# Altium schematic sheet USB_POWER.SchDoc
size A4; SheetNumber: 4; SheetTotal: 5
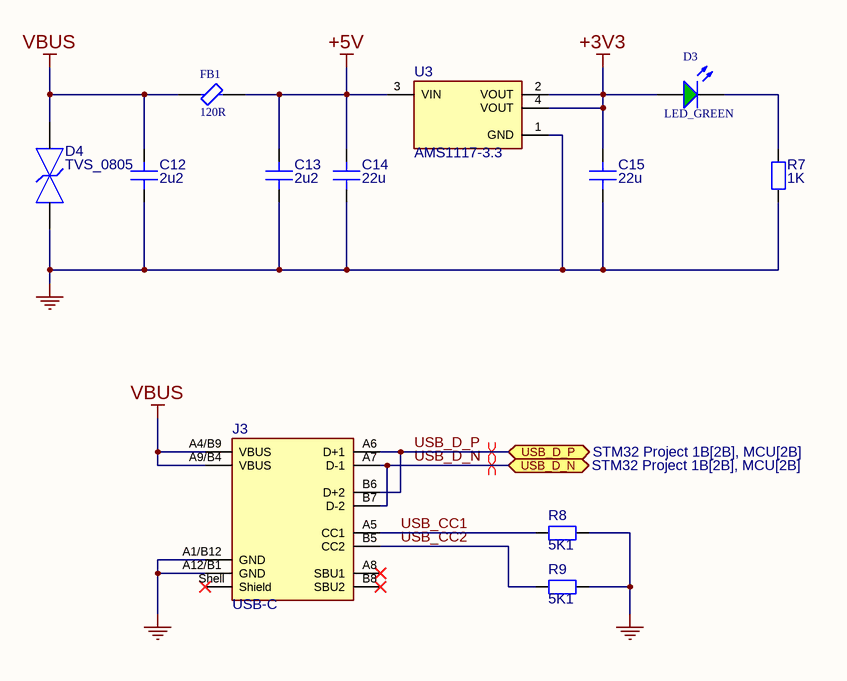
[diagram p0: USB_POWER.SchDoc]

## Parts
C12  2u2  [CAP_0805]
C13  2u2  [CAP_0805]
C14  22u  [CAP_0805]
C15  22u  [CAP_0805]
D3  LED_GREEN  [LED_GREEN_0805]
D4  TVS_0805  [TVS_0805]
FB1  120R  [FERRITE_BEAD_0805]
J3  USB-C  [USB-C SMD 16 Pin]
R7  1K  [RES_0402]
R8  5K1  [RES_0805]
R9  5K1  [RES_0805]
U3  AMS1117-3.3  [AMS1117-3.3]

## Ports
USB_D_N (bidir, see STM32 Project 1B[2B], MCU[2B]), USB_D_P (bidir, see STM32 Project 1B[2B], MCU[2B])

## Nets
+3V3: C15.2 D3.1(A) U3.2(VOUT) U3.4(VOUT)
+5V: C13.2 C14.2 FB1.2 U3.3(VIN)
GND: C12.1 C13.1 C14.1 C15.1 D4.1 J3.A1/B12(GND) J3.A12/B1(GND) R7.1 R8.2 R9.2 U3.1(GND)
VBUS: C12.2 D4.2 FB1.1 J3.A4/B9(VBUS) J3.A9/B4(VBUS)
USB_CC1: J3.A5(CC1) R8.1
USB_CC2: J3.B5(CC2) R9.1
USB_D_N: J3.A7(D-1) J3.B7(D-2) ; port USB_D_N
USB_D_P: J3.A6(D+1) J3.B6(D+2) ; port USB_D_P
NetD3_2: D3.2(K) R7.2

Not connected (* = marked no-connect by the designer): J3 A8(SBU1)* B8(SBU2)* Shell(Shield)*

## Layout directives
differential pair: USB_D_N, USB_D_P

## Library data of the parts
C12-C15 = CAP_0805: Capacitor SMD 0805 Generic; Manufacturer: *; Manufacturer Part Number: *; Tolerance: *; Voltage Rating: *; Dielectric: *
D3 = LED_GREEN_0805: Chip LED, Green, 2.2 V, -40 to 85 degC, 2-Pin SMD, Pb-Free, Tape and Reel; Manufacturer: Avago; No. of Pins: 2; Peak Wavelength: 570nm; SVHC: NoSVHC(16-Jun-2014); Dominant Wavelength: 572nm; Forward Current If: 20mA; Viewing Angle: 170deg; Lens Shape: Rectangular; PIV Max: 5V; External Width: 1.25mm; LED Type: Standard; External Depth: 0.8mm; Opto Mounting Orientation: Top; Luminous Intensity: 15mcd; Luminous Intensity Min: 4mcd; Forward Voltage VF Max: 2.6V; External Length / Height: 2mm; Bulb Size: 1.25mmx1.4mm; Light Area Height: 1mm; Voltage Vf Typ: 2.2V; Operating Temperature Max: 85degC; Datasheet Version: Oct-08; MSL: MSL2A-4weeks; Peak Forward Current: 20mA; Package Description: 2-Pin Surface Mount Device, Body 2 x 1.25 mm, Height 0.8 mm; Datasheet URL: https://datasheet.ciiva.com/29280/180495-da-01-en-chip-led-hsmg-c170-gelb-gruen-29280971.pdf; Storage Temperature Min: -40degC; LED Colour: Green; Wavelength Typ: 570nm; Mounting Type: SMD; Forward Current If Max: 20mA; Dominant Wavelength Typ: 572nm; LED Mounting: SMD; Operating Temperature Range: -30degCto+85degC; Operating Temperature Min: -30degC; Manufacturer URL: http://www.avagotech.com/; Packaging: CutTape; Luminous Intensity Typ: 15mcd; Package Reference: HSMX-C170; Storage Temperature Max: 85degC; Opto Case Style: SMD; Forward Voltage: 2.2V
D4 = TVS_0805: ESD Suppressor SMD 0805; Manufacturer: Panasonic; Manufacturer Part Number: EZA-EG2A50AX; Clamping Voltage: 100V; Direction: Bidirectional; Reverse Standoff Voltage: 30V; Capacitance: 0.05pF; Value: 0.05pF; Number Of Channels: 1; Category: Diode; Package: EZAEG2A; RoHS: TRUE; Lead Free: Yes; Digikey Description: VARISTOR 0402; Temperature: -55°C to +125°C; Mouser Description: ESD Suppressors 15V 0402 SUPPRESSOR ESD; Automotive: No; Temperature Range High: +125°C; Octopart: https://octopart.com/eza-eg2a50ax-panasonic-39557977; Device Class L2: TVS Diodes; ComponentLink2Description: Datasheet; Temperature Range Low: -55°C; Ipc Land Pattern Name: INDC10050X38; Device Class L1: Circuit Protection; ComponentLink2URL: https://industrial.panasonic.com/cdbs/www-data/pdf/AWD0000/AWD0000C23.pdf; Device Class L3: unset; Height: 0.43mm
FB1 = FERRITE_BEAD_0805: FERRITE BEAD 120 OHM 0805 1LN; Number of Lines: 1; DC Resistance-Max: 100mR; Material: Steel; Max DC Current: 200mA; Shielding: Unshielded; Test Frequency: 100MHz; Current Rating: 800mA; Max Current Rating: 1A; Resistance: 150mR; Tolerance: 25%; Width: 1.25mm; Number of Circuits: 1; Military Standard: Not; Height: 0.85mm; Series: BLM21A; Min Operating Temperature: -55°C; DC Resistance (DCR): 100mR; Termination: SMD/SMT; Impedance: 120R; Core Material: Ferrite; REACH SVHC: No SVHC; Radiation Hardening: No; Max Operating Temperature: 125°C; Number of Pins: 2; Case/Package: 0805; Case Code (Imperial): 0805; Frequency: 100MHz; Depth: 1.25mm; Length: 2mm; DC Current: 200mA; Lead Free: Lead Free; Case Code (Metric): 2012; Package Quantity: 1; Packaging: Tape and Reel
J3 = USB-C SMD 16 Pin: Usb Conn, 2.0 Type C, R/A Rcpt, 16P, Smt Rohs Compliant: Yes |Wurth Elektronik 629722000214; Manufacturer: Wurth Electronics; USB Standard: USB 2.0; Current Rating: 5A; Gender: Receptacle; Insulation Resistance: 100MR; Number of Contacts: 12; Voltage Rating: 20V; Pin Length: 950um; Supplier: Newark; Supplier Part Number: 69AK2245; Manufacturer Part Number: 629722000214; RoHS: No; Stock: 1749; Pricing: 1=4.22, 10=3.98, 25=3.76, 50=3.47, 100=3.17, 250=2.8 (USD); Pins: 16; Contact Material: Nickel,Gold; Min Operating Temperature: -40°C; Max Operating Temperature: 85°C; Packaging: Tape and Reel; Height: 3.51mm; ComponentLink1URL: https://datasheet.octopart.com/629722000214-Wurth-Elektronik-datasheet-168263062.pdf?src-supplier=Element14; ComponentLink1Description: https://datasheet.octopart.com/629722000214-Wurth-Elektronik-datasheet-168263062.pdf?src-supplier=Element14
R7-R9 = RES_0805: Resistor SMD 0805 Generic; Manufacturer: *; Manufacturer Part Number: *; Tolerance: *; Package Size: *; Voltage Rating: *
U3 = AMS1117-3.3: LDO Voltage Regulators 1A, 3.3V; Manufacturer: Advanced Monolithic Systems; Dropout Voltage: 1.1V; Output Type: Fixed; Nominal Supply Current: 5mA; Max Power Dissipation: 1.2W; Max Supply Voltage: 15V; Number Of Outputs: 1; Standoff Height: 0.64mm; Max Junction Temp: +125°C; Height: 1.8mm; Package: AMS1117; Device Class L2: Power Management ICs; ComponentLink2Description: Datasheet; ComponentLink2URL: http://www.advanced-monolithic.com/pdf/ds1117.pdf; Category: IC; RoHS: TRUE; Automotive: No; Device Class L1: Integrated Circuits (ICs); Output Current: 1A; Device Class L3: Voltage Regulators - Linear; Temperature: -40°C to +125°C; Output Voltage: 3.3V; Manufacturer Part Number: AMS1117-3.3; Temperature Range Low: -40°C; Octopart: https://octopart.com/ams1117-3.3-advanced+monolithic+systems-25899300; Lead Free: Yes; Ipc Land Pattern Name: SOT229P700X180-4; Temperature Range High: +125°C